# Altium schematic sheet MR_UartConnector.SchDoc
size A4; CompanyName: BeeIonic; SheetNumber: 7; SheetTotal: 7
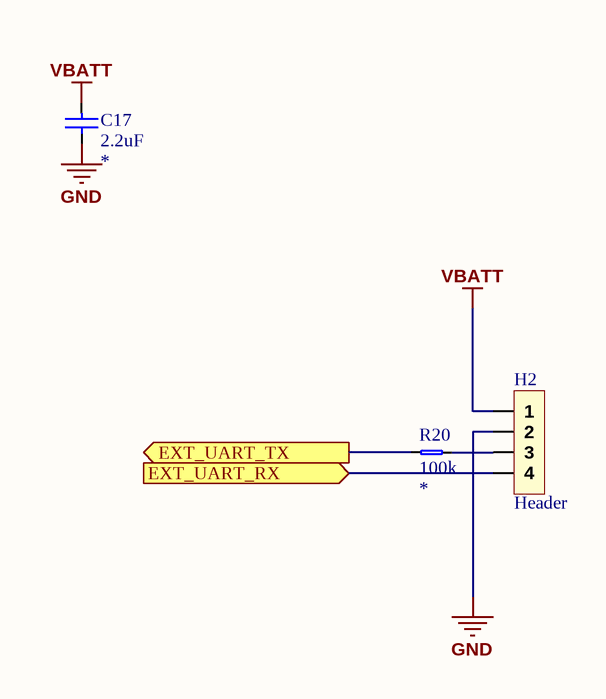
[diagram p0: MR_UartConnector.SchDoc]

## Parts
C17  value 2.2uF  [0603_CAP_LD]  (hidden comment: CerCap)
H2  Header  [HE14 1x4 Straight]
R20  value 100k  [0603_RES_LD]  (hidden comment: Resistor)

## Ports
EXT_UART_RX (in), EXT_UART_TX (out)

## Nets
GND: C17.2 H2.2
VBATT: C17.1 H2.1
EXT_UART_RX: H2.4 ; port EXT_UART_RX
EXT_UART_TX: R20.1 ; port EXT_UART_TX
NetH2_3: H2.3 R20.2

## Notes on the sheet
- Project :
- Title :
- Sheet:
- of
- Creation Date :
- Designer :
- Modified Date :

## Library data of the parts
C17 = CerCap: Ceramic Capacitor; Type: *; Voltage/Power: *; Package: *
H2 = Header_4x1: Header 4x1 PIns
R20 = Resistor: Precision: *; Package: *